# EAGLE design labwiz-module_single_breakout (EAGLE 6.5.0)

## Sheet 1 of 2
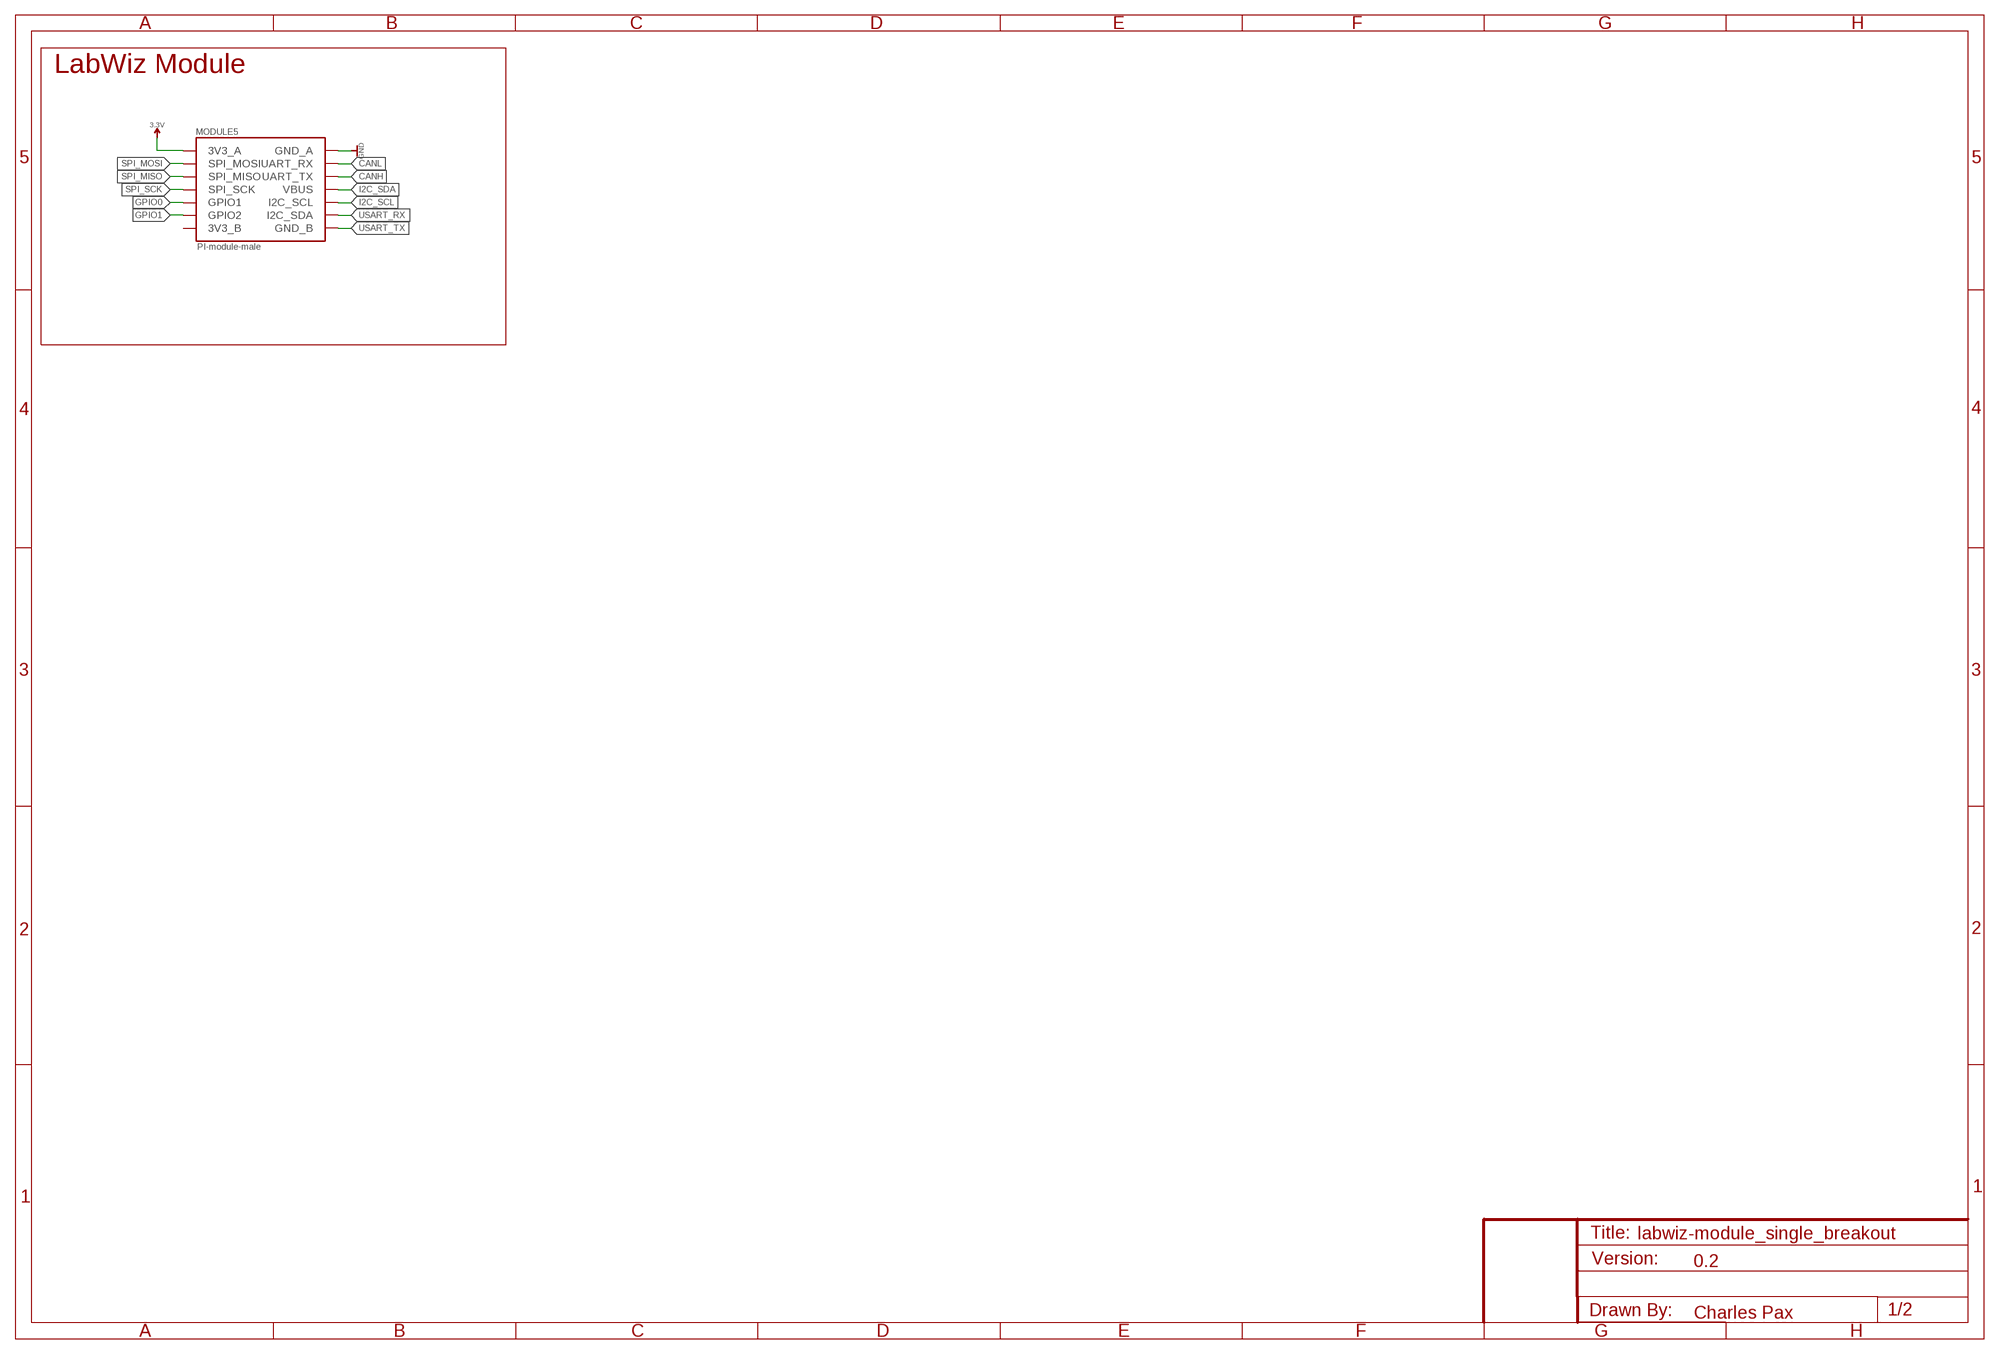
[diagram p0: schematic, sheet 1]

### Parts
MODULE5  PI-module-male  PAX_MODULE_EDGE_MALE_MODULE  [M07X2_2MM_EDGE]

### Nets
3.3V: MODULE5.P$13(3V3_A)
CANH: MODULE5.P$10(UART_TX)
CANL: MODULE5.P$12(UART_RX)
GND: MODULE5.P$14(GND_A)
GPIO0: MODULE5.P$5(GPIO1)
GPIO1: MODULE5.P$3(GPIO2)
I2C_SCL: MODULE5.P$6(I2C_SCL)
I2C_SDA: MODULE5.P$8(VBUS)
SPI_MISO: MODULE5.P$9(SPI_MISO)
SPI_MOSI: MODULE5.P$11(SPI_MOSI)
SPI_SCK: MODULE5.P$7(SPI_SCK)
USART_RX: MODULE5.P$4(I2C_SDA)
USART_TX: MODULE5.P$2(GND_B)
Unconnected: MODULE5.P$1(3V3_B)

### Notes on the sheet
- LabWiz Module
- 0.2
- Charles Pax

## Sheet 2 of 2

## Library data of the parts
MODULE5 = PaxInstruments-Connectors:PAX_MODULE; MF: Pax Instruments; MPN: PIxxxx

## Net classes
0 Digital signal: width 0.1 mm, drill 0.2 mm, clearance 0.15 mm
1 3.3V power: width 0.1 mm, drill 0.2 mm, clearance 0.15 mm
2 RTC battery: width 0.1 mm, drill 0.2 mm, clearance 0.15 mm
3 5V power: width 0.1 mm, drill 0.2 mm, clearance 0.15 mm
4 Analog signal: width 0.1 mm, drill 0.2 mm, clearance 0.15 mm
5 GND: width 0.1 mm, drill 0.2 mm, clearance 0.15 mm

## Board
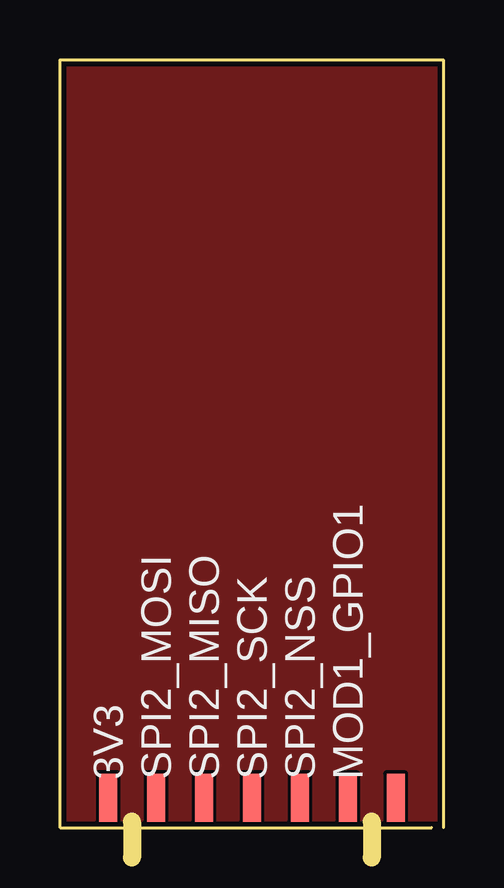
[diagram p1: board, top side]
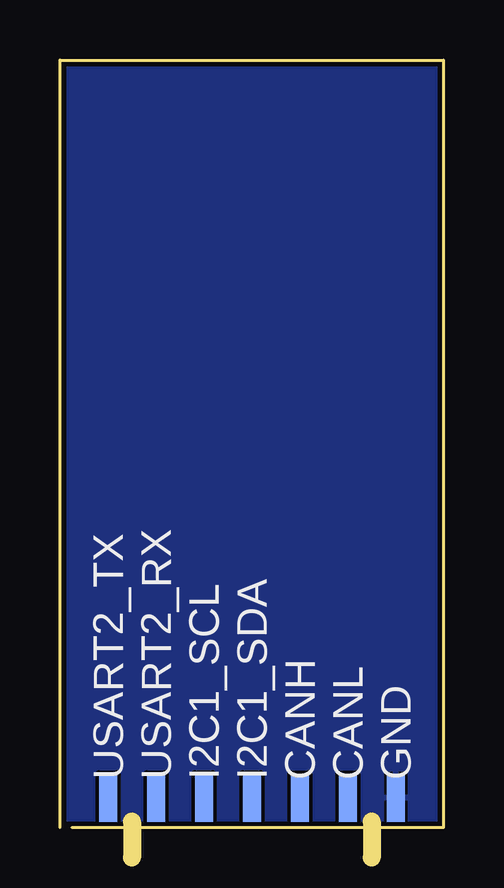
[diagram p2: board, bottom side, seen from below]

Size 16 x 32 mm. Coordinates in mm from the lower left corner, seen from the top.
Outline: 15.5,0 0,0 0,32 16,32 16,0
Copper layers (1*2+15*16): Top 0.017mm / dielectric 0.5mm / GND 0.017mm / dielectric 0.075mm / 3.3V 0.017mm / dielectric 0.5mm / Bottom 0.017mm
Design rules "PaxInstrument-T400 *": minimum track width 0.1mm, minimum drill 0.2mm, track to track 0.075mm, track to pad 0.075mm, pad to pad 0.075mm, via to via 0.075mm, smd to smd 0.075mm, copper to edge 0.2mm, drill to drill 0.2mm, minimum pad ring 0.5mm, minimum via ring 0.05mm, stop-mask expansion 0.01mm, vias tented up to drill 0.25mm, thermal gap 0.1mm
Milling: 2 lines

### Footprints (pad centres in the part's own frame; a part is rotated, then mirrored left to right if it is on the bottom)
M07X2_2MM_EDGE = smd 0.75 x 2: P$1 0,-0.25; P$3 2,-0.25; P$5 4,-0.25; P$7 6,-0.25; P$9 8,-0.25; P$11 10,-0.25; P$13 12,-0.25 | smd 0.75 x 2 bottom: P$2 0,-0.25; P$4 2,-0.25; P$6 4,-0.25; P$8 6,-0.25; P$10 8,-0.25; P$12 10,-0.25; P$14 12,-0.25

### Placement (x,y rotation side)
MODULE5  14,1 180 top

### Tracks (layer width: path | path; a pad name or v marks a point on that pad's centre or on a via)
GND
  pour Bottom: 0,32 0,0 16,0 16,32
  pour Top: 16,32 16,0 0,0 0,32

### Text on the board
tPlace: 3V3 | SPI2_MOSI | SPI2_MISO | SPI2_SCK | SPI2_NSS | MOD1_GPIO1
bPlace: GND | CANL | CANH | I2C1_SDA | I2C1_SCL | USART2_RX | USART2_TX